# Altium schematic sheet bridge.SchDoc
size A4
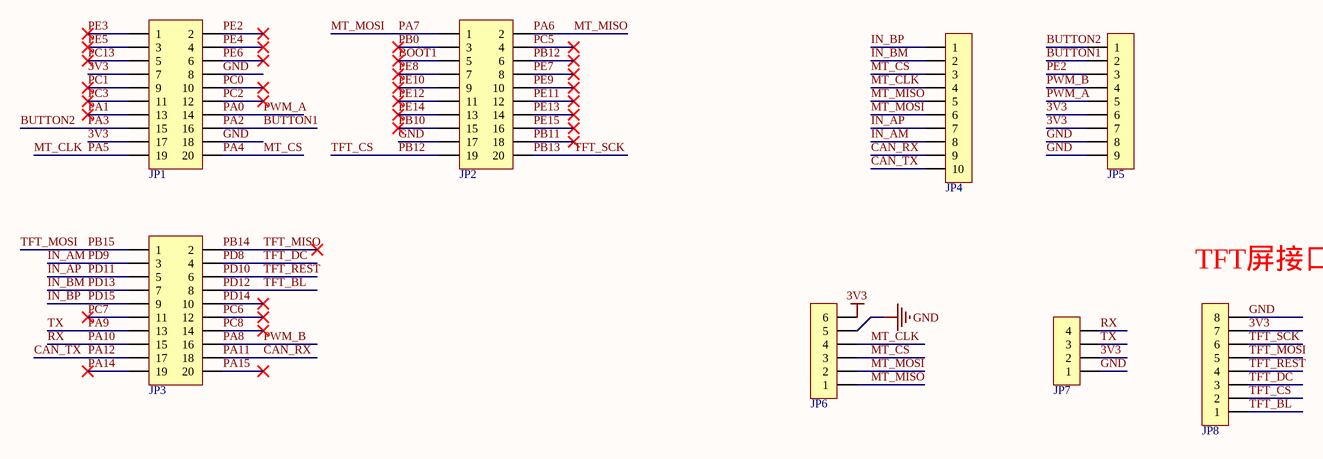
[diagram p0: bridge.SchDoc]

## Parts
JP1  Header 2X10  [HDR2.54-LI-2x10P]  (value not drawn)
JP2  Header 2X10  [HDR2.54-LI-2x10P]  (value not drawn)
JP3  Header 2X10  [HDR2.54-LI-2x10P]  (value not drawn)
JP4  CON-10P  [SH1.0-WT-10P]  (value not drawn)
JP5  CON-9P  [SH1.0-WT-9P]  (value not drawn)
JP6  HDR-1X6  [HDR2.54-LI-6P]  (value not drawn)
JP7  HDR-1X4  [HDR2.54-LI-4P]  (value not drawn)
JP8  HDR-1X8  [HDR2.54-M-LI-8P]  (value not drawn)

## Nets
3V3: JP1.7 JP1.17 JP5.6 JP5.7 JP6.6 JP7.2 JP8.7
GND: JP1.8 JP1.18 JP2.17 JP5.8 JP5.9 JP6.5 JP7.1 JP8.8
BOOT1: JP2.5
BUTTON1: JP1.16 JP5.2  [also labelled PA2]
BUTTON2: JP1.15 JP5.1  [also labelled PA3]
CAN_RX: JP3.18 JP4.9  [also labelled PA11]
CAN_TX: JP3.17 JP4.10  [also labelled PA12]
IN_AM: JP3.3 JP4.8  [also labelled PD9]
IN_AP: JP3.5 JP4.7  [also labelled PD11]
IN_BM: JP3.7 JP4.2  [also labelled PD13]
IN_BP: JP3.9 JP4.1  [also labelled PD15]
MT_CLK: JP1.19 JP4.4 JP6.4  [also labelled PA5]
MT_CS: JP1.20 JP4.3 JP6.3  [also labelled PA4]
MT_MISO: JP2.2 JP4.5 JP6.1  [also labelled PA6]
MT_MOSI: JP2.1 JP4.6 JP6.2  [also labelled PA7]
PA0: JP1.14 JP5.5  [also labelled PWM_A]
PA1: JP1.13
PA8: JP3.16 JP5.4  [also labelled PWM_B]
PA9: JP3.13 JP7.3  [also labelled TX]
PA10: JP3.15 JP7.4  [also labelled RX]
PA14: JP3.19
PA15: JP3.20
PB0: JP2.3
PB10: JP2.15
PB11: JP2.18
PB12: JP2.6 JP2.19 JP8.2  [also labelled TFT_CS]
PB13: JP2.20 JP8.6  [also labelled TFT_SCK]
PB14: JP3.2  [also labelled TFT_MISO]
PB15: JP3.1 JP8.5  [also labelled TFT_MOSI]
PC0: JP1.10
PC1: JP1.9
PC2: JP1.12
PC3: JP1.11
PC5: JP2.4
PC6: JP3.12
PC7: JP3.11
PC8: JP3.14
PC13: JP1.5
PD8: JP3.4 JP8.3  [also labelled TFT_DC]
PD10: JP3.6 JP8.4  [also labelled TFT_REST]
PD12: JP3.8 JP8.1  [also labelled TFT_BL]
PD14: JP3.10
PE2: JP1.2 JP5.3
PE3: JP1.1
PE4: JP1.4
PE5: JP1.3
PE6: JP1.6
PE7: JP2.8
PE8: JP2.7
PE9: JP2.10
PE10: JP2.9
PE11: JP2.12
PE12: JP2.11
PE13: JP2.14
PE14: JP2.13
PE15: JP2.16

## Notes on the sheet
- (near JP8) TFT屏接口

## Library data of the parts
JP1-JP3 = Header 10X2: 10*2P接插件; 联系卖家，免费查找封装: 唯一出售店铺网址https://shop463601444.taobao.com; 封装库来自淘宝卖家ID:黄晶宝石: 其他店铺购入均为盗版假冒封装库，请立即申请退款，本店现金奖励20~200元; BOM名称: 10*2P接插件
JP4 = Header 10: 10P连接器; 联系卖家 免费查找封装: 唯一出售店铺网址https://shop463601444.taobao.com; 联系卖家 免费技术支持: 封装库来自淘宝卖家ID：黄晶宝石; BOM名称: 10P连接器
JP5 = Header 9: 9P连接器; 联系卖家 免费查找封装: 唯一出售店铺网址https://shop463601444.taobao.com; 联系卖家 免费技术支持: 封装库来自淘宝卖家ID：黄晶宝石; BOM名称: 9P连接器
JP6 = Header 6: 6P接插件; 联系卖家，免费查找封装: 唯一出售店铺网址https://shop463601444.taobao.com; 封装库来自淘宝卖家ID:黄晶宝石: 其他店铺购入均为盗版假冒封装库，请立即申请退款，本店现金奖励20~200元; BOM名称: 6P接插件
JP7 = Header 4: 4P接插件; 联系卖家，免费查找封装: 唯一出售店铺网址https://shop463601444.taobao.com; 封装库来自淘宝卖家ID:黄晶宝石: 其他店铺购入均为盗版假冒封装库，请立即申请退款，本店现金奖励20~200元; BOM名称: 4P接插件
JP8 = Header 8: 8P接插件; 联系卖家，免费查找封装: 唯一出售店铺网址https://shop463601444.taobao.com; 封装库来自淘宝卖家ID:黄晶宝石: 其他店铺购入均为盗版假冒封装库，请立即申请退款，本店现金奖励20~200元; BOM名称: 8P接插件